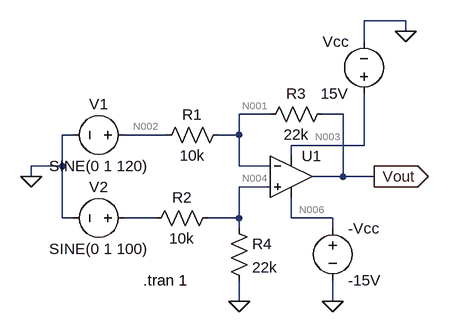
[diagram p0: schematic Q3.asc]
Q3.asc, the LTspice schematic file:
Version 4
SHEET 1 880 680
WIRE 352 -112 288 -112
WIRE 352 -96 352 -112
WIRE 288 -80 288 -112
WIRE 144 32 96 32
WIRE 256 32 224 32
WIRE -160 64 -176 64
WIRE -16 64 -80 64
WIRE 96 64 96 32
WIRE 96 64 64 64
WIRE 288 80 288 0
WIRE 288 80 176 80
WIRE 176 96 176 80
WIRE -176 112 -176 64
WIRE -176 112 -224 112
WIRE 96 112 96 64
WIRE 144 112 96 112
WIRE -224 128 -224 112
WIRE 256 128 256 32
WIRE 256 128 208 128
WIRE 304 128 256 128
WIRE 144 144 96 144
WIRE -176 192 -176 112
WIRE -160 192 -176 192
WIRE -32 192 -80 192
WIRE 96 192 96 144
WIRE 96 192 48 192
WIRE 176 192 176 160
WIRE 240 192 176 192
WIRE 96 208 96 192
WIRE 240 208 240 192
WIRE 96 320 96 288
WIRE 240 320 240 288
FLAG 304 128 Vout
IOPIN 304 128 Out
FLAG 96 320 0
FLAG -224 128 0
FLAG 352 -96 0
FLAG 240 320 0
SYMBOL Opamps\\UniversalOpamp2 176 128 R0
SYMATTR InstName U1
SYMBOL res 64 176 R90
WINDOW 0 0 56 VBottom 2
WINDOW 3 32 56 VTop 2
SYMATTR InstName R2
SYMATTR Value 10k
SYMBOL res 80 48 R90
WINDOW 0 0 56 VBottom 2
WINDOW 3 32 56 VTop 2
SYMATTR InstName R1
SYMATTR Value 10k
SYMBOL res 240 16 R90
WINDOW 0 0 56 VBottom 2
WINDOW 3 32 56 VTop 2
SYMATTR InstName R3
SYMATTR Value 22k
SYMBOL res 80 192 R0
SYMATTR InstName R4
SYMATTR Value 22k
SYMBOL voltage -64 64 R90
WINDOW 0 -32 56 VBottom 2
WINDOW 3 32 56 VTop 2
WINDOW 123 0 0 Left 0
WINDOW 39 0 0 Left 0
SYMATTR InstName V1
SYMATTR Value SINE(0 1 120)
SYMBOL voltage -64 192 R90
WINDOW 0 -32 56 VBottom 2
WINDOW 3 32 56 VTop 2
WINDOW 123 0 0 Left 0
WINDOW 39 0 0 Left 0
SYMATTR InstName V2
SYMATTR Value SINE(0 1 100)
SYMBOL voltage 288 16 R180
WINDOW 0 24 96 Left 2
WINDOW 3 24 16 Left 2
SYMATTR InstName Vcc
SYMATTR Value 15V
SYMBOL voltage 240 192 R0
SYMATTR InstName -Vcc
SYMATTR Value -15V
TEXT -52 288 Left 2 !.tran 1

The netlist it stands for:
* Q3.asc
XU1 N004 N001 N003 N006 Vout level.2 Avol=1Meg GBW=10Meg Slew=10Meg ilimit=25m rail=0 Vos=0 phimargin=45 en=0 enk=0 in=0 ink=0 Rin=500Meg  ; pins IN+ IN- V+ V- OUT
R2 N004 N005 10k
R1 N001 N002 10k
R3 Vout N001 22k
R4 N004 0 22k
V1 N002 0 SINE(0 1 120)
V2 N005 0 SINE(0 1 100)
Vcc N003 0 15V
V§-Vcc N006 0 -15V
.tran 1
.lib UniversalOpamps2.sub
.backanno
.end

* Results of the author's LTspice run, read from the files saved beside the schematic
* Operating Point, zero values left out:
*   V(n003) = 15 V
*   V(n006) = -15 V
*   I(-vcc) = 1.498 mA
*   I(Vcc) = -1.498 mA
*   Ix(u1:3) = 1.498 mA
*   Ix(u1:4) = -1.498 mA
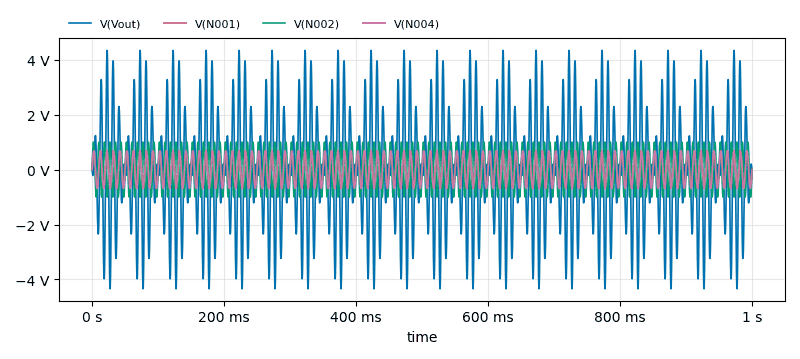
[diagram p1: Transient Analysis of Q3.asc, plotted from the saved traces]
* Transient Analysis, 1 run:
*   V(Vout): min -4.339 V, max 4.341 V, average -565.6 µV, rms 2.188 V, last 24.05 µV
*   V(N001): min -685.5 mV, max 685.5 mV, average 3.273 µV, rms 483.1 mV, last 7.514 µV
*   V(N002): min -999.8 mV, max 999.7 mV, average 166.7 µV, rms 713.6 mV, last 0 V
*   V(N004): min -685.5 mV, max 685.5 mV, average 3.246 µV, rms 483.2 mV, last 0 V